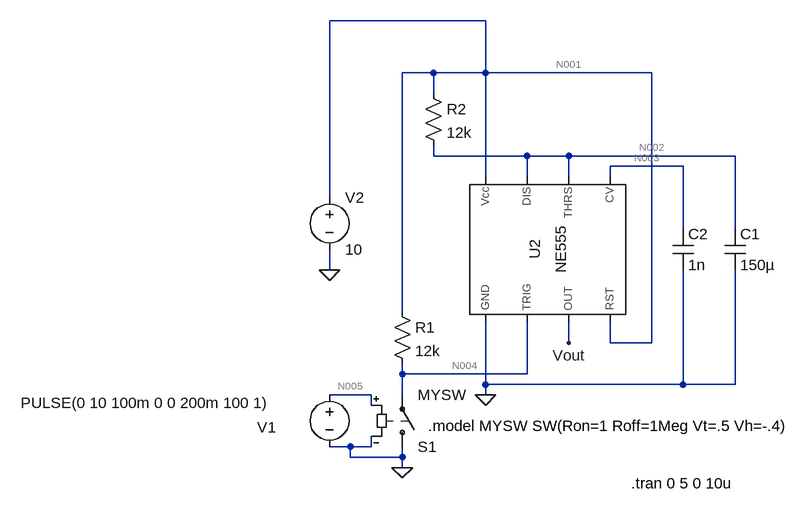
[diagram p0: schematic cto1.asc]
cto1.asc, the LTspice schematic file:
Version 4
SHEET 1 888 680
WIRE 224 -160 -16 -160
WIRE 144 -80 96 -80
WIRE 224 -80 224 -160
WIRE 224 -80 144 -80
WIRE 480 -80 224 -80
WIRE 144 -48 144 -80
WIRE 144 48 144 32
WIRE 288 48 144 48
WIRE 352 48 288 48
WIRE 608 48 352 48
WIRE 528 64 416 64
WIRE 224 80 224 -80
WIRE 288 80 288 48
WIRE 352 80 352 48
WIRE 416 80 416 64
WIRE -16 112 -16 -160
WIRE 528 160 528 64
WIRE 608 160 608 48
WIRE -16 224 -16 192
WIRE 96 288 96 -80
WIRE 352 336 352 304
WIRE 416 336 416 304
WIRE 480 336 480 -80
WIRE 480 336 416 336
WIRE 96 384 96 368
WIRE 288 384 288 304
WIRE 288 384 96 384
WIRE 224 400 224 304
WIRE 528 400 528 224
WIRE 528 400 224 400
WIRE 608 400 608 224
WIRE 608 400 528 400
WIRE 48 416 -16 416
WIRE 96 416 96 384
WIRE 224 416 224 400
WIRE 48 432 48 416
WIRE 16 496 -16 496
WIRE 48 496 48 480
WIRE 48 496 16 496
WIRE 16 512 16 496
WIRE 96 512 96 496
WIRE 96 512 16 512
WIRE 96 528 96 512
FLAG 224 416 0
FLAG 96 528 0
FLAG -16 224 0
FLAG 352 336 Vout
SYMBOL Misc\\NE555 320 192 R270
SYMATTR InstName U2
SYMBOL res 80 272 R0
SYMATTR InstName R1
SYMATTR Value 12k
SYMBOL res 128 -64 R0
SYMATTR InstName R2
SYMATTR Value 12k
SYMBOL cap 592 160 R0
SYMATTR InstName C1
SYMATTR Value 150µ
SYMBOL cap 512 160 R0
SYMATTR InstName C2
SYMATTR Value 1n
SYMBOL sw 96 512 M180
SYMATTR InstName S1
SYMATTR Value MYSW
SYMBOL voltage -16 400 R0
WINDOW 0 -111 66 Left 2
WINDOW 3 -475 28 Left 2
WINDOW 123 0 0 Left 0
WINDOW 39 0 0 Left 0
SYMATTR InstName V1
SYMATTR Value PULSE(0 10 100m 0 0 200m 100 1)
SYMBOL voltage -16 96 R0
WINDOW 123 0 0 Left 0
WINDOW 39 0 0 Left 0
SYMATTR InstName V2
SYMATTR Value 10
TEXT 448 552 Left 2 !.tran 0 5 0 10u
TEXT 136 464 Left 2 !.model MYSW SW(Ron=1 Roff=1Meg Vt=.5 Vh=-.4)

The netlist it stands for:
* cto1.asc
XU2 0 N004 Vout N001 N003 N002 N002 N001 NE555  ; pins GND TRIG OUT RST CV THRS DIS Vcc
R1 N001 N004 12k
R2 N001 N002 12k
C1 N002 0 150µ
C2 N003 0 1n
S1 0 N004 N005 0 MYSW
V1 N005 0 PULSE(0 10 100m 0 0 200m 100 1)
V2 N001 0 10
.tran 0 5 0 10u
.model MYSW SW(Ron=1 Roff=1Meg Vt=.5 Vh=-.4)
.lib NE555.sub
.backanno
.end

* Results of the author's LTspice run, read from the files saved beside the schematic
* Operating Point, zero values left out:
*   V(n004) = 9.881 V
*   V(n003) = 6.667 V
*   V(n001) = 10 V
*   V(n002) = 10 V
*   V(vout) = 10 V
*   I(R2) = 23.34 nA
*   I(R1) = 9.891 µA
*   I(S1) = 9.881 µA
*   I(V2) = -3.243 mA
*   Ix(u2:1) = -3.233 mA
*   Ix(u2:2) = 9.881 nA
*   Ix(u2:4) = 56 µA
*   Ix(u2:6) = 10 nA
*   Ix(u2:7) = 13.34 nA
*   Ix(u2:8) = 3.177 mA
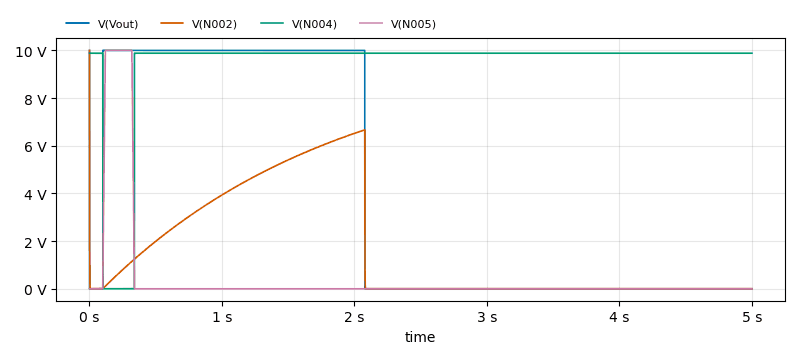
[diagram p1: Transient Analysis of cto1.asc, plotted from the saved traces]
* Transient Analysis, 1 run:
*   V(Vout): min 60 µV, max 10 V, average 3.954 V, rms 6.288 V, last 60 µV
*   V(N002): min 4.998 mV, max 10 V, average 1.562 V, rms 2.751 V, last 4.998 mV
*   V(N004): min 833.3 µV, max 9.881 V, average 9.41 V, rms 9.643 V, last 9.881 V
*   V(N005): min 0 V, max 10 V, average 440 mV, rms 2.071 V, last 0 V